# EAGLE schematic open-bldc (EAGLE 5.06)
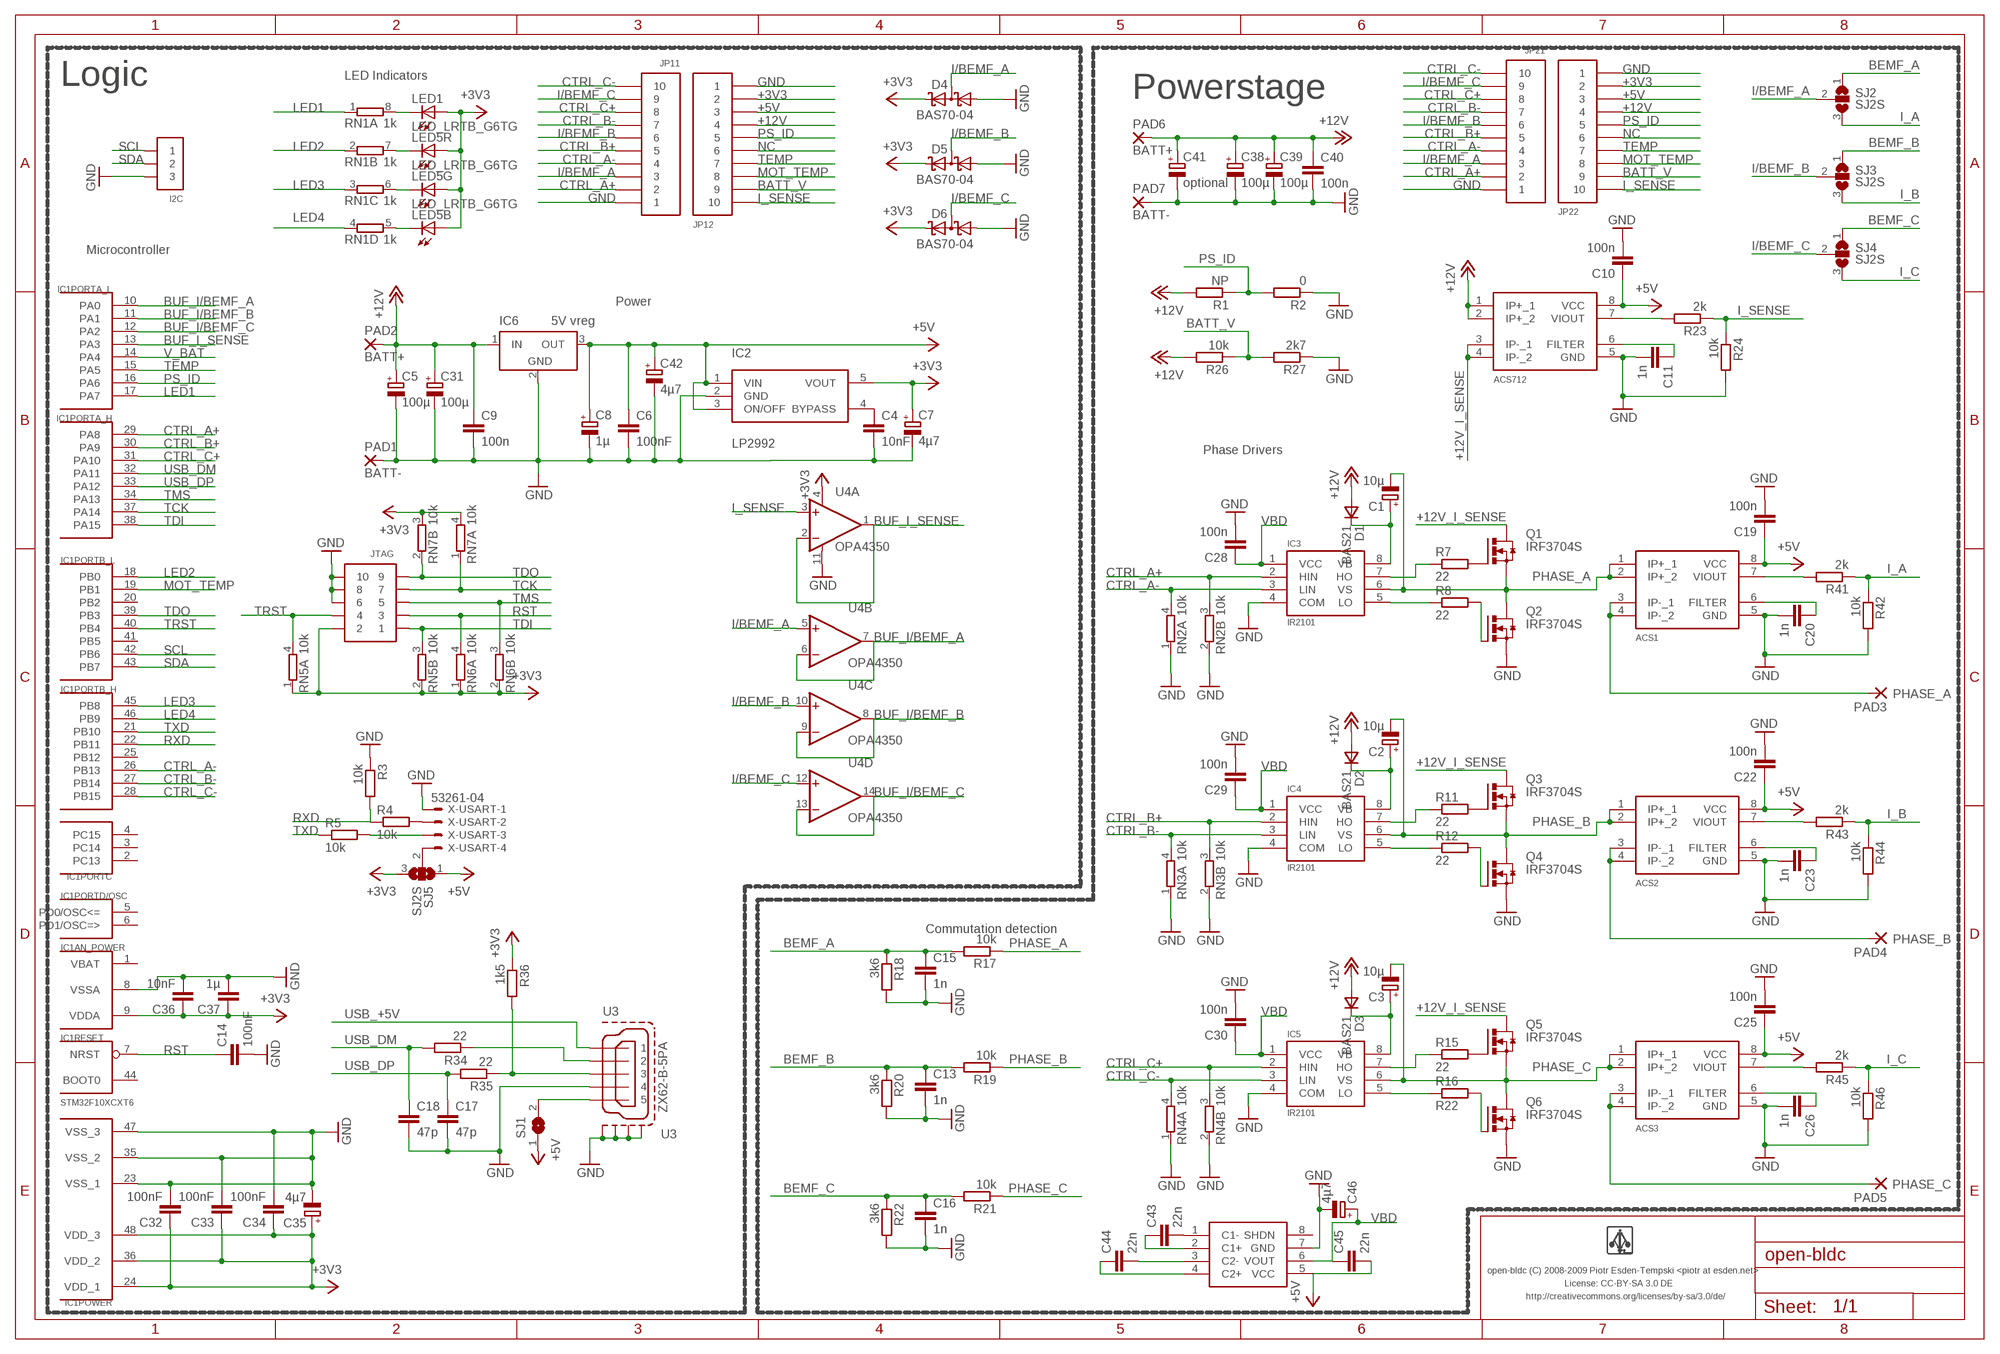
[diagram p0: schematic, sheet 1]

## Parts
ACS1  ACS712  [SO8]
ACS2  ACS712  [SO8]
ACS3  ACS712  [SO8]
ACS712  ACS712  [SO8]
C1  10µ  CPOL-EUA/3216-18R  [A/3216-18R]
C2  10µ  CPOL-EUA/3216-18R  [A/3216-18R]
C3  10µ  CPOL-EUA/3216-18R  [A/3216-18R]
C4  10nF  C-EUC0603  [C0603]
C5  100µ  CPOL-EUD/7343-31R  [D/7343-31R]
C6  100nF  C-EUC0603  [C0603]
C7  4µ7  CPOL-EUA/3216-18R  [A/3216-18R]
C8  1µ  CPOL-EUA/3216-18R  [A/3216-18R]
C9  100n  C-EUC0603  [C0603]
C10  100n  C-EUC0603  [C0603]
C11  1n  C-EUC0603  [C0603]
C13  1n  C-EUC0603  [C0603]
C14  100nF  C-EUC0603  [C0603]
C15  1n  C-EUC0603  [C0603]
C16  1n  C-EUC0603  [C0603]
C17  47p  C-EUC0603  [C0603]
C18  47p  C-EUC0603  [C0603]
C19  100n  C-EUC0603  [C0603]
C20  1n  C-EUC0603  [C0603]
C22  100n  C-EUC0603  [C0603]
C23  1n  C-EUC0603  [C0603]
C25  100n  C-EUC0603  [C0603]
C26  1n  C-EUC0603  [C0603]
C28  100n  C-EUC0603  [C0603]
C29  100n  C-EUC0603  [C0603]
C30  100n  C-EUC0603  [C0603]
C31  100µ  CPOL-EUD/7343-31R  [D/7343-31R]
C32  100nF  C-EUC0603  [C0603]
C33  100nF  C-EUC0603  [C0603]
C34  100nF  C-EUC0603  [C0603]
C35  4µ7  CPOL-EUA/3216-18R  [A/3216-18R]
C36  10nF  C-EUC0603  [C0603]
C37  1µ  C-EUC0603  [C0603]
C38  100µ  CPOL-EUD/7343-31R  [D/7343-31R]
C39  100µ  CPOL-EUD/7343-31R  [D/7343-31R]
C40  100n  C-EUC0603  [C0603]
C41  optional  CPOL-EUE5-6  [E5-6]
C42  4µ7  CPOL-EUA/3216-18R  [A/3216-18R]
C43  22n  C-EUC0603  [C0603]
C44  22n  C-EUC0603  [C0603]
C45  22n  C-EUC0603  [C0603]
C46  4µ7  CPOL-EUA/3216-18R  [A/3216-18R]
D1  BAS21  VAR2SOT23  [SOT-23]
D2  BAS21  VAR2SOT23  [SOT-23]
D3  BAS21  VAR2SOT23  [SOT-23]
D4  BAS70-04  [SOT23]
D5  BAS70-04  [SOT23]
D6  BAS70-04  [SOT23]
I2C  PIN_HDR_EDG_1.27MM_3-1  [PIN_HDR_EDG_1.27MM_3-1]
IC1  STM32F10XCXT6  [TQFP48]
IC2  LP2992  [SOT23-5]
IC3  IR2101  [SO-8]
IC4  IR2101  [SO-8]
IC5  IR2101  [SO-8]
IC6  5V vreg  LT1129CST5  [SOT223]
IC7  ST662A  [SO8]
JP11  PIN_HDR_1.27MM_10  [PIN_HDR_1.27MM_10]
JP12  PIN_HDR_1.27MM_10  [PIN_HDR_1.27MM_10]
JP21  PIN_HDR_1.27MM_10  [PIN_HDR_1.27MM_10]
JP22  PIN_HDR_1.27MM_10  [PIN_HDR_1.27MM_10]
JTAG  PIN_HDR_EDG_1.27MM_5-2  [PIN_HDR_EDG_1.27MM_5-2]
LED1  AMBER  LEDCHIP-LED0603  [CHIP-LED0603]
LED5  LED_LRTB_G6TG  [PLCC6]
PAD1  BATT-  SMD5  [SMD2,54-5,08]
PAD2  BATT+  SMD5  [SMD2,54-5,08]
PAD3  PHASE_A  SMD5  [SMD2,54-5,08]
PAD4  PHASE_B  SMD5  [SMD2,54-5,08]
PAD5  PHASE_C  SMD5  [SMD2,54-5,08]
PAD6  BATT+  SMD5  [SMD2,54-5,08]
PAD7  BATT-  SMD5  [SMD2,54-5,08]
Q1  IRF3704S  [D2PACK]
Q2  IRF3704S  [D2PACK]
Q3  IRF3704S  [D2PACK]
Q4  IRF3704S  [D2PACK]
Q5  IRF3704S  [D2PACK]
Q6  IRF3704S  [D2PACK]
R1  NP  R-EU_R0603  [R0603]
R2  0  R-EU_R0603  [R0603]
R3  10k  R-EU_R0603  [R0603]
R4  10k  R-EU_R0603  [R0603]
R5  10k  R-EU_R0603  [R0603]
R7  22  R-EU_R0603  [R0603]
R8  22  R-EU_R0603  [R0603]
R11  22  R-EU_R0603  [R0603]
R12  22  R-EU_R0603  [R0603]
R15  22  R-EU_R0603  [R0603]
R16  R22  R-EU_R0603  [R0603]
R17  10k  R-EU_R0603  [R0603]
R18  3k6  R-EU_R0603  [R0603]
R19  10k  R-EU_R0603  [R0603]
R20  3k6  R-EU_R0603  [R0603]
R21  10k  R-EU_R0603  [R0603]
R22  3k6  R-EU_R0603  [R0603]
R23  2k  R-EU_R0603  [R0603]
R24  10k  R-EU_R0603  [R0603]
R26  10k  R-EU_R0603  [R0603]
R27  2k7  R-EU_R0603  [R0603]
R34  22  R-EU_R0603  [R0603]
R35  22  R-EU_R0603  [R0603]
R36  1k5  R-EU_R0603  [R0603]
R41  2k  R-EU_R0603  [R0603]
R42  10k  R-EU_R0603  [R0603]
R43  2k  R-EU_R0603  [R0603]
R44  10k  R-EU_R0603  [R0603]
R45  2k  R-EU_R0603  [R0603]
R46  10k  R-EU_R0603  [R0603]
RN1  1k  4R-N0603-ARC  [0603-ARC]
RN2  10k  2R-NEXB34V  [EXB34V]
RN3  10k  2R-NEXB34V  [EXB34V]
RN4  10k  2R-NEXB34V  [EXB34V]
RN5  10k  2R-NEXB34V  [EXB34V]
RN6  10k  2R-NEXB34V  [EXB34V]
RN7  10k  2R-NEXB34V  [EXB34V]
SJ1  SJ  [SJ]
SJ2  SJ2S  [SJ2S]
SJ3  SJ2S  [SJ2S]
SJ4  SJ2S  [SJ2S]
SJ5  SJ2S  [SJ2S]
U3  ZX62-B-5PA  [ZX62-B-5PA]
U4  OPA4350  [SO14]
X-USART  53261-04  [53261-04]

## Nets
+3V3: C7.+ C32.1 C33.1 C34.1 C35.+ C36.1 C37.1 D4.2(C2) D5.2(C2) D6.2(C2) IC1.9(AN_POWER:VDDA) IC1.24(POWER:VDD_1) IC1.36(POWER:VDD_2) IC1.48(POWER:VDD_3) IC2.5(VOUT) JP12.P$2 JP22.P$2 JTAG.P$2 LED1.A LED5.A1(R:A) LED5.A2(G:A) LED5.A3(B:A) R36.1 RN5.1 RN5.2 RN6.1 RN6.2 RN7.3 RN7.4 SJ5.3 U4.4(A:V+)
+5V: ACS1.8(VCC) ACS2.8(VCC) ACS3.8(VCC) ACS712.8(VCC) C6.1 C8.+ C10.1 C19.1 C22.1 C25.1 C42.+ C45.2 IC2.1(VIN) IC2.3(ON/OFF) IC6.3(OUT) IC7.5(VCC) JP12.P$3 JP22.P$3 SJ1.1 SJ5.1
+12V: ACS712.1(IP+_1) ACS712.2(IP+_2) C5.+ C9.1 C31.+ C38.+ C39.+ C40.1 C41.+ D1.3(A) D2.3(A) D3.3(A) IC6.1(IN) JP12.P$4 JP22.P$4 PAD2.1(P) PAD6.1(P) R1.2 R26.2
+12V_I_SENSE: ACS712.3(IP-_1) ACS712.4(IP-_2) Q1.2(D) Q3.2(D) Q5.2(D)
BATT_V: JP12.P$9 JP22.P$9 R26.1 R27.2
BEMF_A: C15.1 R17.2 R18.1 SJ2.1
BEMF_B: C13.1 R19.2 R20.1 SJ3.1
BEMF_C: C16.1 R21.2 R22.1 SJ4.1
BUF_I/BEMF_A: IC1.10(PORTA_L:PA0) U4.6(B:-IN) U4.7(B:OUT)
BUF_I/BEMF_B: IC1.11(PORTA_L:PA1) U4.8(C:OUT) U4.9(C:-IN)
BUF_I/BEMF_C: IC1.12(PORTA_L:PA2) U4.13(D:-IN) U4.14(D:OUT)
BUF_I_SENSE: IC1.13(PORTA_L:PA3) U4.1(A:OUT) U4.2(A:-IN)
CTRL_A+: IC1.29(PORTA_H:PA8) IC3.2(HIN) JP11.P$2 JP21.P$2 RN2.3
CTRL_A-: IC1.26(PORTB_H:PB13) IC3.3(LIN) JP11.P$4 JP21.P$4 RN2.4
CTRL_B+: IC1.30(PORTA_H:PA9) IC4.2(HIN) JP11.P$5 JP21.P$5 RN3.3
CTRL_B-: IC1.27(PORTB_H:PB14) IC4.3(LIN) JP11.P$7 JP21.P$7 RN3.4
CTRL_C+: IC1.31(PORTA_H:PA10) IC5.2(HIN) JP11.P$8 JP21.P$8 RN4.3
CTRL_C-: IC1.28(PORTB_H:PB15) IC5.3(LIN) JP11.P$10 JP21.P$10 RN4.4
GND: ACS1.5(GND) ACS2.5(GND) ACS3.5(GND) ACS712.5(GND) C4.2 C5.- C6.2 C7.- C8.- C9.2 C10.2 C11.2 C13.2 C14.2 C15.2 C16.2 C17.2 C18.2 C19.2 C20.2 C22.2 C23.2 C25.2 C26.2 C28.2 C29.2 C30.2 C31.- C32.2 C33.2 C34.2 C35.- C36.2 C37.2 C38.- C39.- C40.2 C41.- C42.- C46.- D4.1(A1) D5.1(A1) D6.1(A1) I2C.P$3 IC1.8(AN_POWER:VSSA) IC1.23(POWER:VSS_1) IC1.35(POWER:VSS_2) IC1.47(POWER:VSS_3) IC2.2(GND) IC3.4(COM) IC4.4(COM) IC5.4(COM) IC6.2(GND) IC7.7(GND) JP11.P$1 JP12.P$1 JP21.P$1 JP22.P$1 JTAG.P$6 JTAG.P$8 JTAG.P$10 PAD1.1(P) PAD7.1(P) Q2.3(S) Q4.3(S) Q6.3(S) R2.1 R3.1 R18.2 R20.2 R22.2 R24.2 R27.1 R42.2 R44.2 R46.2 RN2.1 RN2.2 RN3.1 RN3.2 RN4.1 RN4.2 U3.GND_LEFT(S1) U3.GND_RIGHT(S2) U3.GND_UP_LEFT(S3) U3.GND_UP_RIGHT(S4) U3.PIN_4 U4.11(A:V-) X-USART.1
I/BEMF_A: D4.3(C1A2) JP11.P$3 JP21.P$3 SJ2.2 U4.5(B:+IN)
I/BEMF_B: D5.3(C1A2) JP11.P$6 JP21.P$6 SJ3.2 U4.10(C:+IN)
I/BEMF_C: D6.3(C1A2) JP11.P$9 JP21.P$9 SJ4.2 U4.12(D:+IN)
I_A: R41.1 R42.1 SJ2.3
I_B: R43.1 R44.1 SJ3.3
I_C: R45.1 R46.1 SJ4.3
I_SENSE: JP12.P$10 JP22.P$10 R23.1 R24.1 U4.3(A:+IN)
LED1: IC1.17(PORTA_L:PA7) RN1.1
LED2: IC1.18(PORTB_L:PB0) RN1.2
LED3: IC1.45(PORTB_H:PB8) RN1.3
LED4: IC1.46(PORTB_H:PB9) RN1.4
MOT_TEMP: IC1.19(PORTB_L:PB1) JP12.P$8 JP22.P$8
N$1: IC4.7(HO) R11.1
N$2: IC3.7(HO) R7.1
N$3: LED1.C RN1.8
N$4: LED5.C1(R:C) RN1.7
N$5: LED5.C2(G:C) RN1.6
N$6: ACS712.7(VIOUT) R23.2
N$7: IC3.5(LO) R8.1
N$8: SJ5.2 X-USART.4
N$9: R4.2 X-USART.2
N$10: LED5.C3(B:C) RN1.5
N$11: Q1.1(G) R7.2
N$12: C1.+ D1.1(C) IC3.8(VB)
N$13: IC4.5(LO) R12.1
N$14: Q3.1(G) R11.2
N$15: Q5.1(G) R15.2
N$16: C2.+ D2.1(C) IC4.8(VB)
N$17: Q6.1(G) R16.2
N$18: IC5.7(HO) R15.1
N$19: IC5.5(LO) R16.1
N$20: R5.2 X-USART.3
N$21: C3.+ D3.1(C) IC5.8(VB)
N$22: C4.1 IC2.4(BYPASS)
N$23: ACS712.6(FILTER) C11.1
N$24: C43.2 IC7.1(C1-)
N$25: R34.1 U3.PIN_2
N$26: SJ1.2 U3.PIN_5
N$27: C44.2 IC7.3(C2-)
N$28: R35.1 R36.2 U3.PIN_3
N$29: C43.1 IC7.2(C1+)
N$30: C44.1 IC7.4(C2+)
N$31: ACS1.6(FILTER) C20.1
N$32: ACS1.7(VIOUT) R41.2
N$34: ACS2.6(FILTER) C23.1
N$35: ACS2.7(VIOUT) R43.2
N$37: ACS3.6(FILTER) C26.1
N$38: ACS3.7(VIOUT) R45.2
N$40: ACS1.3(IP-_1) ACS1.4(IP-_2) PAD3.1(P)
N$41: ACS2.3(IP-_1) ACS2.4(IP-_2) PAD4.1(P)
N$42: ACS3.3(IP-_1) ACS3.4(IP-_2) PAD5.1(P)
N$43: Q2.1(G) R8.2
N$44: Q4.1(G) R12.2
NC: JP12.P$6 JP22.P$6
PHASE_A: ACS1.1(IP+_1) ACS1.2(IP+_2) C1.- IC3.6(VS) Q1.3(S) Q2.2(D) R17.1
PHASE_B: ACS2.1(IP+_1) ACS2.2(IP+_2) C2.- IC4.6(VS) Q3.3(S) Q4.2(D) R19.1
PHASE_C: ACS3.1(IP+_1) ACS3.2(IP+_2) C3.- IC5.6(VS) Q5.3(S) Q6.2(D) R21.1
PS_ID: IC1.16(PORTA_L:PA6) JP12.P$5 JP22.P$5 R1.1 R2.2
RST: C14.1 IC1.7(RESET:NRST) JTAG.P$3 RN6.4
RXD: IC1.22(PORTB_H:PB11) R3.2 R4.1
SCL: I2C.P$1 IC1.42(PORTB_L:PB6)
SDA: I2C.P$2 IC1.43(PORTB_L:PB7)
TCK: IC1.37(PORTA_H:PA14) JTAG.P$7 RN7.1
TDI: IC1.38(PORTA_H:PA15) JTAG.P$1 RN5.3
TDO: IC1.39(PORTB_L:PB3) JTAG.P$9 RN7.2
TEMP: IC1.15(PORTA_L:PA5) JP12.P$7 JP22.P$7
TMS: IC1.34(PORTA_H:PA13) JTAG.P$5 RN6.3
TRST: IC1.40(PORTB_L:PB4) JTAG.P$4 RN5.4
TXD: IC1.21(PORTB_H:PB10) R5.1
USB_+5V: U3.PIN_1
USB_DM: C18.1 IC1.32(PORTA_H:PA11) R34.2
USB_DP: C17.1 IC1.33(PORTA_H:PA12) R35.2
V_BAT: IC1.14(PORTA_L:PA4)
VBD: C28.1 C29.1 C30.1 C45.1 C46.+ IC3.1(VCC) IC4.1(VCC) IC5.1(VCC) IC7.6(VOUT)
Unconnected: IC1.2(PORTC:PC13) IC1.3(PORTC:PC14) IC1.4(PORTC:PC15) IC1.5(PORTD/OSC:PD0/OSC<=) IC1.6(PORTD/OSC:PD1/OSC=>) IC1.20(PORTB_L:PB2) IC1.25(PORTB_H:PB12) IC1.41(PORTB_L:PB5) IC1.44(RESET:BOOT0) IC7.8(SHDN)

## Notes on the sheet
- LED Indicators
- Logic
- Powerstage
- Microcontroller
- Power
- Phase Drivers
- Commutation detection
- open-bldc (C) 2008-2009 Piotr Esden-Tempski <piotr at esden.net>
- License: CC-BY-SA 3.0 DE
- http://creativecommons.org/licenses/by-sa/3.0/de/

## Power pins joined to a net without a drawn wire
GND: IC6.4(GND)
VBAT: IC1.1(AN_POWER:VBAT)

## Library data of the parts
ACS1-ACS3 ACS712 = open-bldc:ACS712
C1-C3 C5 C7 C8 C31 C35 C38 C39 C41 C42 C46 = rcl:CPOL-EU: POLARIZED CAPACITOR, European symbol
C4 C6 C9-C11 C13-C20 C22 C23 C25 C26 C28-C30 C32-C34 C36 C37 C40 C43-C45 = rcl:C-EU: CAPACITOR, European symbol
D1-D3 = zetex:VAR2SOT23: DIODE
D4-D6 = diode:BAS70-04: Silicon Schottky Diodes General-purpose diode for high-speed switching
I2C = open-bldc:PIN_HDR_EDG_1.27MM_3-1
IC1 = stm32:STM32F10XCXT6: ST STM32F101/103 48pin LQFP
IC2 = open-bldc:LP2992
IC3-IC5 = open-bldc:IR2101
IC6 = linear-technology:LT1129CST5: VOLTAGE REGULATOR with shutdown
IC7 = open-bldc:ST662A
JP11 JP12 JP21 JP22 = open-bldc:PIN_HDR_1.27MM_10
JTAG = open-bldc:PIN_HDR_EDG_1.27MM_5-2
LED1 = led:LED: LED OSRAM: - CHIPLED LG R971, LG N971, LY N971, LG Q971, LY Q971, LO R971, LY R971 LH N974, LH R974 LS Q976, LO Q976, LY Q976 LO Q996 - Hyper CHIPLED LW Q18S LB Q993, LB Q99A, LB R99A - SideLED LS A670, LO A670, LY A670, LG A670, LP A670 LB A673, LV A673, LT A673, LW A673 LH A674 LY A675 LS A676, LA A676, LO A676, LY A676, LW A676 LS A679, LY A679, LG A679 - Hyper Micro SIDELED® LS Y876, LA Y876, LO Y876, LY Y876 LT Y87S - SmartLED LW L88C, LW L88S LB L89C, LB L89S, LG L890 LS L89K, LO L89K, LY L89K LS L896, LA L896, LO L896, LY L896 - TOPLED LS T670, LO T670, LY T670, LG T670, LP T670 LSG T670, LSP T670, LSY T670, LOP T670, LYG T670 LG T671, LOG T671, LSG T671 LB T673, LV T673, LT T673, LW T673 LH T674 LS T676, LA T676, LO T676, LY T676, LB T676, LH T676, LSB T676, LW T676 LB T67C, LV T67C, LT T67C, LS T67K, LO T67K, LY T67K, LW E67C LS E67B, LA E67B, LO E67B, LY E67B, LB E67C, LV E67C, LT E67C LW T67C LS T679, LY T679, LG T679 LS T770, LO T770, LY T770, LG T770, LP T770 LB T773, LV T773, LT T773, LW T773 LH T774 LS E675, LA E675, LY E675, LS T675 LS T776, LA T776, LO T776, LY T776, LB T776 LHGB T686 LT T68C, LB T68C - Hyper Mini TOPLED® LB M676 - Mini TOPLED Santana® LG M470 LS M47K, LO M47K, LY M47K Source: http://www.osram.convergy.de LUXEON: - LUMILED® LXK2-PW12-R00, LXK2-PW12-S00, LXK2-PW14-U00, LXK2-PW14-V00 LXK2-PM12-R00, LXK2-PM12-S00, LXK2-PM14-U00 LXK2-PE12-Q00, LXK2-PE12-R00, LXK2-PE12-S00, LXK2-PE14-T00, LXK2-PE14-U00 LXK2-PB12-K00, LXK2-PB12-L00, LXK2-PB12-M00, LXK2-PB14-N00, LXK2-PB14-P00, LXK2-PB14-Q00 LXK2-PR12-L00, LXK2-PR12-M00, LXK2-PR14-Q00, LXK2-PR14-R00 LXK2-PD12-Q00, LXK2-PD12-R00, LXK2-PD12-S00 LXK2-PH12-R00, LXK2-PH12-S00 LXK2-PL12-P00, LXK2-PL12-Q00, LXK2-PL12-R00 Source: www.luxeon.com KINGBRIGHT: KA-3528ASYC Source: www.kingbright.com
LED5 = open-bldc:LED_LRTB_G6TG
PAD1-PAD7 = wirepad:SMD5: SMD PAD
Q1-Q6 = my-transistor-power:IRF3704: SMPS MOSFET HEXFET® Power MOSFET Source: http://www.irf.com/product-info/datasheets/data/irf3704.pdf
R1-R5 R7 R8 R11 R12 R15-R24 R26 R27 R34-R36 R41-R46 = rcl:R-EU_: RESISTOR, European symbol
RN1 = resistor-dil:4R-N: Array Chip Resistor Source: RS Component / Phycomp
RN2-RN7 = resistor-dil:2R-N: Array Chip Resistor Source: Panasonic
SJ1 = jumper:SJ: SMD solder JUMPER
SJ2-SJ5 = open-bldc:SJ2S
U3 = open-bldc:ZX62-B-5PA
U4 = patrick:OPA4350
X-USART = con-molex:53?-04: CONNECTOR wire to board 1.25 mm (.049 inch) pitch header

## Net classes
0 default: width 0.152 mm, drill 0.305 mm, clearance 0.152 mm